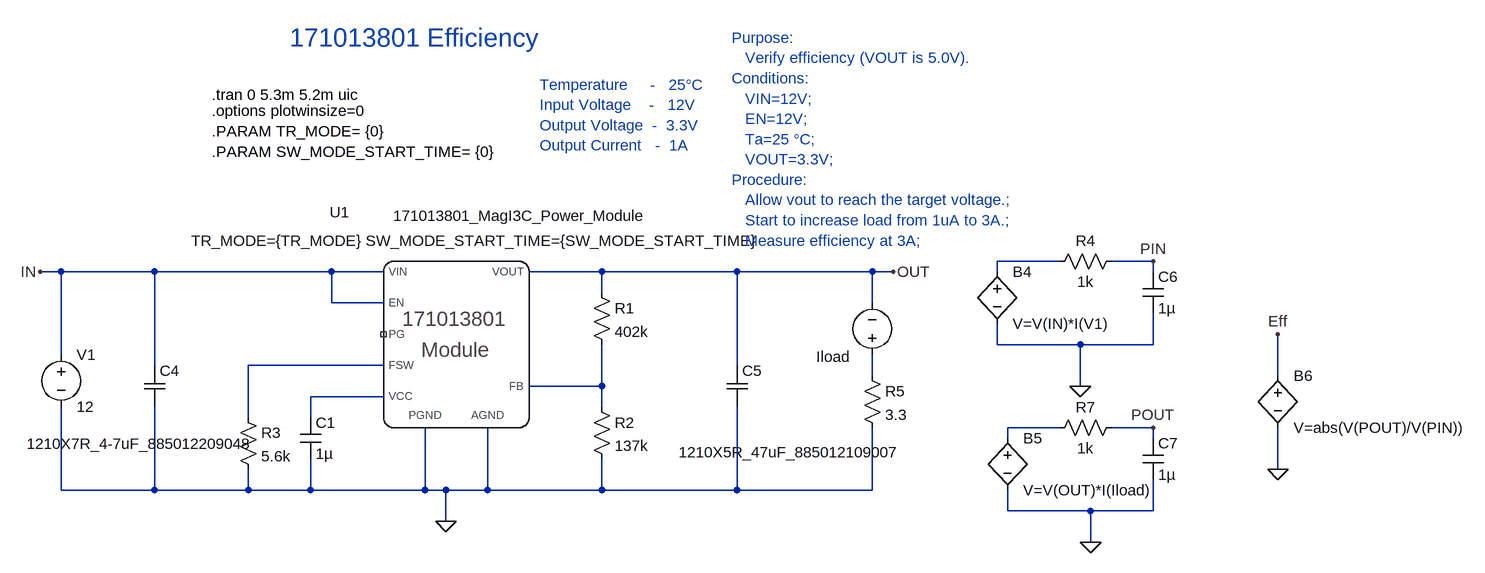
[diagram p0: schematic 171013801 Efficiency VIN12 VOUT3V3 IOUT1A.asc]
171013801 Efficiency VIN12 VOUT3V3 IOUT1A.asc, the LTspice schematic file:
Version 4
SHEET 1 2108 680
WIRE 1152 32 1056 32
WIRE 1296 32 1232 32
WIRE -384 48 -416 48
WIRE -240 48 -384 48
WIRE 32 48 -240 48
WIRE 112 48 32 48
WIRE 448 48 336 48
WIRE 656 48 448 48
WIRE 864 48 656 48
WIRE 896 48 864 48
WIRE 1056 48 1056 32
WIRE 1296 48 1296 32
WIRE 448 80 448 48
WIRE 32 96 32 48
WIRE 112 96 32 96
WIRE 864 96 864 48
WIRE 1056 160 1056 128
WIRE 1184 160 1056 160
WIRE 1296 160 1296 112
WIRE 1296 160 1184 160
WIRE -384 176 -384 48
WIRE -240 192 -240 48
WIRE 112 192 -96 192
WIRE 656 192 656 48
WIRE 864 208 864 176
WIRE 1488 208 1488 144
WIRE 448 224 448 160
WIRE 448 224 336 224
WIRE 1184 224 1184 160
WIRE 112 240 0 240
WIRE 448 256 448 224
WIRE -96 272 -96 192
WIRE 0 272 0 240
WIRE 1152 288 1072 288
WIRE 1296 288 1232 288
WIRE 1072 304 1072 288
WIRE 1296 304 1296 288
WIRE 1488 352 1488 288
WIRE -384 384 -384 256
WIRE -240 384 -240 256
WIRE -240 384 -384 384
WIRE -96 384 -96 352
WIRE -96 384 -240 384
WIRE 0 384 0 336
WIRE 0 384 -96 384
WIRE 176 384 176 288
WIRE 176 384 0 384
WIRE 208 384 176 384
WIRE 272 384 272 288
WIRE 272 384 208 384
WIRE 448 384 448 336
WIRE 448 384 272 384
WIRE 656 384 656 256
WIRE 656 384 448 384
WIRE 864 384 864 288
WIRE 864 384 656 384
WIRE 1072 416 1072 384
WIRE 1200 416 1072 416
WIRE 1296 416 1296 368
WIRE 1296 416 1200 416
WIRE 208 432 208 384
WIRE 1200 464 1200 416
FLAG 208 432 0
FLAG -416 48 IN
FLAG 896 48 OUT
FLAG 1184 224 0
FLAG 1200 464 0
FLAG 1488 352 0
FLAG 1488 144 Eff
FLAG 1296 32 PIN
FLAG 1296 288 POUT
SYMBOL res 432 64 R0
SYMATTR InstName R1
SYMATTR Value 402k
SYMBOL res 432 240 R0
SYMATTR InstName R2
SYMATTR Value 137k
SYMBOL res -112 256 R0
SYMATTR InstName R3
SYMATTR Value 5.6k
SYMBOL cap -16 272 R0
SYMATTR InstName C1
SYMATTR Value 1µ
SYMATTR SpiceLine Rser=7.13m Lser=257p
SYMBOL voltage -384 160 R0
WINDOW 123 0 0 Left 0
WINDOW 39 0 0 Left 0
SYMATTR InstName V1
SYMATTR Value 12
SYMBOL res 1248 16 R90
WINDOW 0 0 56 VBottom 2
WINDOW 3 32 56 VTop 2
SYMATTR InstName R4
SYMATTR Value 1k
SYMBOL cap 1280 48 R0
SYMATTR InstName C6
SYMATTR Value 1µ
SYMBOL bv 1056 32 R0
SYMATTR InstName B4
SYMATTR Value V=V(IN)*I(V1)
SYMBOL bv 1072 288 R0
SYMATTR InstName B5
SYMATTR Value V=V(OUT)*I(Iload)
SYMBOL res 1248 272 R90
WINDOW 0 0 56 VBottom 2
WINDOW 3 32 56 VTop 2
SYMATTR InstName R7
SYMATTR Value 1k
SYMBOL cap 1280 304 R0
SYMATTR InstName C7
SYMATTR Value 1µ
SYMBOL bv 1488 192 R0
SYMATTR InstName B6
SYMATTR Value V=abs(V(POUT)/V(PIN))
SYMBOL voltage 864 192 R180
WINDOW 123 0 0 Left 0
WINDOW 39 24 124 Left 2
WINDOW 0 86 13 Right 2
SYMATTR InstName Iload
SYMATTR Value ""
SYMBOL res 848 192 R0
SYMATTR InstName R5
SYMATTR Value 3.3
SYMBOL WCAP-CSGP_50V_DCbias -256 192 R0
WINDOW 38 -181 121 Left 2
SYMATTR SpiceModel 1210X7R_4-7uF_885012209048
SYMATTR InstName C4
SYMBOL WCAP-CSGP_10V_DCbias 640 192 R0
WINDOW 38 -74 134 Left 2
SYMATTR SpiceModel 1210X5R_47uF_885012109007
SYMATTR InstName C5
SYMBOL 171013801_MagI3C_Power_Module 256 64 R0
SYMATTR InstName U1
TEXT -32 -312 Left 4 ;171013801 Efficiency
TEXT 648 -312 Left 2 ;Purpose: \n   Verify efficiency (VOUT is 5.0V). \nConditions: \n   VIN=12V; \n   EN=12V; \n   Ta=25 °C; \n   VOUT=3.3V; \nProcedure: \n   Allow vout to reach the target voltage.; \n   Start to increase load from 1uA to 3A.; \n   Measure efficiency at 3A;
TEXT -152 -224 Left 2 !.tran 0 5.3m 5.2m uic
TEXT -152 -200 Left 2 !.options plotwinsize=0
TEXT -152 -168 Left 2 !.PARAM TR_MODE= {0}\n.PARAM SW_MODE_START_TIME= {0}
TEXT 352 -240 Left 2 ;Temperature     -   25°C\nInput Voltage    -   12V\nOutput Voltage  -  3.3V\nOutput Current   -  1A

The netlist it stands for:
* 171013801 Efficiency VIN12 VOUT3V3 IOUT1A.asc
R1 OUT N004 402k
R2 N004 0 137k
R3 N002 0 5.6k
C1 N005 0 1µ Rser=7.13m Lser=257p
V1 IN 0 12
R4 PIN N001 1k
C6 PIN 0 1µ
B4 N001 0 V=V(IN)*I(V1)
B5 N006 0 V=V(OUT)*I(Iload)
R7 POUT N006 1k
C7 POUT 0 1µ
B6 Eff 0 V=abs(V(POUT)/V(PIN))
V§Iload N003 OUT
R5 N003 0 3.3
XC4 IN 0 1210X7R_4-7uF_885012209048  ; pins A B
XC5 OUT 0 1210X5R_47uF_885012109007  ; pins A B
XU1 OUT N004 IN IN NC_01 N002 N005 0 0 171013801_MagI3C_Power_Module TR_MODE={TR_MODE} SW_MODE_START_TIME={SW_MODE_START_TIME}  ; pins VOUT FB VIN EN PG FSW VCC PGND AGND
* 171013801 Efficiency
* Purpose:
*    Verify efficiency (VOUT is 5.0V).
* Conditions:
*    VIN=12V;
*    EN=12V;
*    Ta=25 °C;
*    VOUT=3.3V;
* Procedure:
*    Allow vout to reach the target voltage.;
*    Start to increase load from 1uA to 3A.;
*    Measure efficiency at 3A;
.tran 0 5.3m 5.2m uic
.options plotwinsize=0
.PARAM TR_MODE= {0}
.PARAM SW_MODE_START_TIME= {0}
* Temperature     -   25°C
* Input Voltage    -   12V
* Output Voltage  -  3.3V
* Output Current   -  1A
.lib WCAP-CSGP_50V_DCbias.lib
.lib WCAP-CSGP_10V_DCbias.lib
.lib 171013801.lib
.backanno
.end